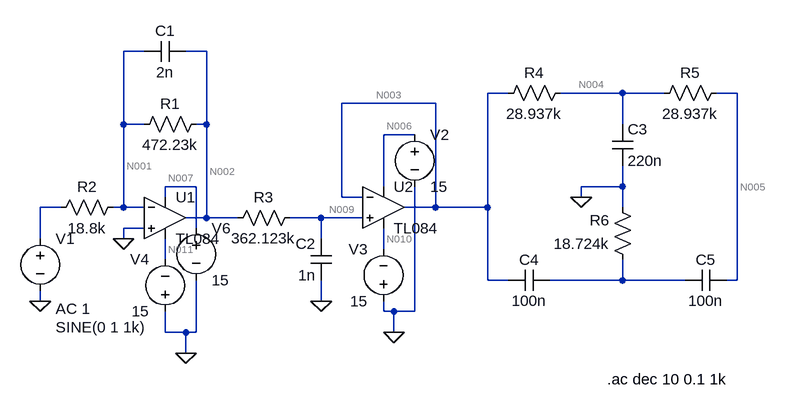
[diagram p0: schematic Combined.asc]
* Combined.asc
R1 N002 N001 472.23k
R2 N001 N008 18.8k
R3 N009 N002 362.123k
* U1: TL084 (symbol TL084 not available, pins judged from their places): In+=0 In-=N001 V+=N007 V-=N011 OUT=N002
* U2: TL084 (symbol TL084 not available, pins judged from their places): In+=N009 In-=N003 V+=N006 V-=N010 OUT=N003
C1 N002 N001 2n
C2 0 N009 1n
V1 N008 0 SINE(0 1 1k) AC 1
V2 N006 0 15
V3 0 N010 15
V4 0 N011 15
V6 N007 0 15
R4 N004 N003 28.937k
R5 N005 N004 28.937k
R6 N012 0 18.724k
C3 N004 0 220n
C4 N012 N003 100n
C5 N005 N012 100n
.ac dec 10 0.1 1k
.backanno
.end

* Results of the author's LTspice run, read from the files saved beside the schematic
* Operating Point, zero values left out:
*   V(n002) = 307.8 µV
*   V(n001) = 10.97 µV
*   V(n009) = 291.5 µV
*   V(n011) = -15 V
*   V(n007) = 15 V
*   V(n003) = 302.4 µV
*   V(n010) = -15 V
*   V(n006) = 15 V
*   V(n004) = 302.4 µV
*   V(n005) = 302.4 µV
*   I(R1) = 628.5 pA
*   I(R2) = 583.5 pA
*   I(R3) = -45.05 pA
*   I(V1) = 583.5 pA
*   I(V2) = -14.19 mA
*   I(V3) = -14.19 mA
*   I(V4) = -14.19 mA
*   I(V6) = -14.19 mA
*   Ix(u1:1) = 45.05 pA
*   Ix(u1:2) = 45.05 pA
*   Ix(u1:3) = 14.19 mA
*   Ix(u1:4) = -14.19 mA
*   Ix(u1:5) = -673.6 pA
*   Ix(u2:1) = 45.05 pA
*   Ix(u2:2) = 45.05 pA
*   Ix(u2:3) = 14.19 mA
*   Ix(u2:4) = -14.19 mA
*   Ix(u2:5) = -45.05 pA
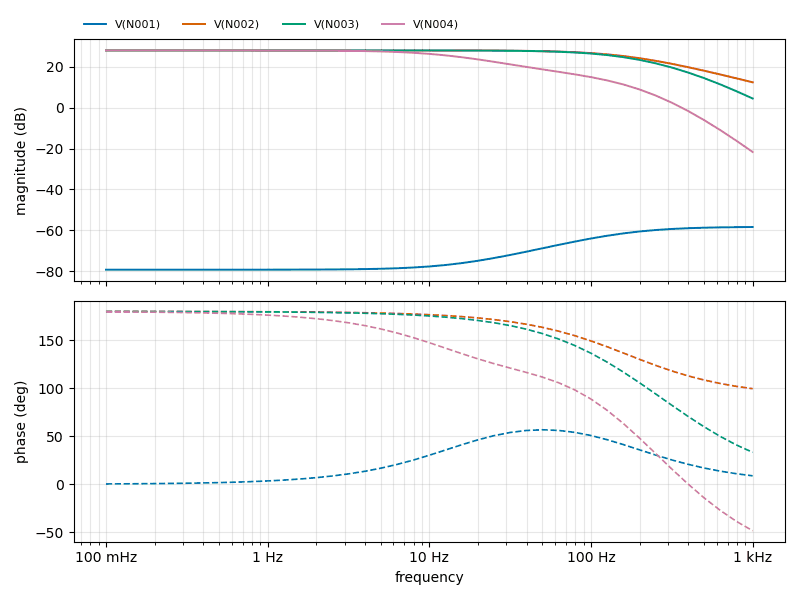
[diagram p1: AC Analysis of Combined.asc, plotted from the saved traces]
* AC Analysis, 1 run:
*   V(N001): -79.21 dB at 100 mHz, -58.34 dB at 1 kHz, peak -58.34 dB at 1 kHz, 3 dB below the peak at 163 Hz
*   V(N002): 28.00 dB at 100 mHz, 12.40 dB at 1 kHz, peak 28.00 dB at 100 mHz, 3 dB below the peak at 167.5 Hz
*   V(N003): 28.00 dB at 100 mHz, 4.49 dB at 1 kHz, peak 28.00 dB at 100 mHz, 3 dB below the peak at 148.8 Hz
*   V(N004): 28.00 dB at 100 mHz, -21.66 dB at 1 kHz, peak 28.00 dB at 100 mHz, 3 dB below the peak at 14.64 Hz